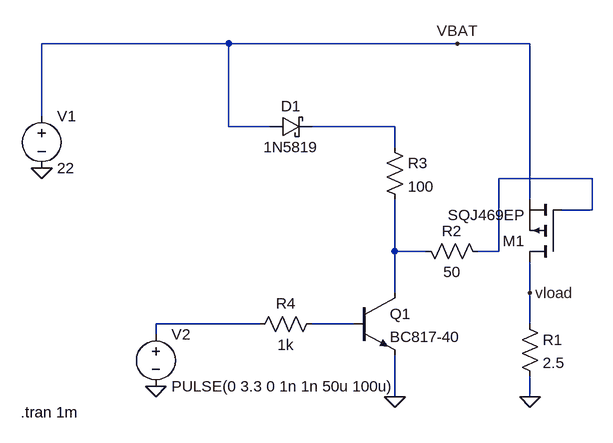
[diagram p0: schematic IceLander-Power-Switching.asc]
IceLander-Power-Switching.asc, the LTspice schematic file:
Version 4
SHEET 1 880 680
WIRE -192 -64 -480 -64
WIRE 160 -64 -192 -64
WIRE 272 -64 160 -64
WIRE -480 48 -480 -64
WIRE -192 64 -192 -64
WIRE -128 64 -192 64
WIRE 64 64 -64 64
WIRE 64 96 64 64
WIRE 368 144 224 144
WIRE 272 176 272 -64
WIRE 368 192 368 144
WIRE 368 192 320 192
WIRE 64 256 64 176
WIRE 112 256 64 256
WIRE 224 256 224 144
WIRE 224 256 192 256
WIRE 64 320 64 256
WIRE 272 320 272 272
WIRE -144 368 -304 368
WIRE 0 368 -64 368
WIRE 272 368 272 320
WIRE -304 384 -304 368
WIRE 64 480 64 416
WIRE 272 480 272 448
FLAG 272 480 0
FLAG 64 480 0
FLAG 160 -64 VBAT
FLAG -480 128 0
FLAG -304 464 0
FLAG 272 320 vload
SYMBOL pmos 320 272 R180
SYMATTR InstName M1
SYMATTR Value SQJ469EP
SYMBOL res 256 352 R0
SYMATTR InstName R1
SYMATTR Value 2.5
SYMBOL npn 0 320 R0
SYMATTR InstName Q1
SYMATTR Value BC817-40
SYMBOL res 96 240 M90
WINDOW 0 0 56 VBottom 2
WINDOW 3 32 56 VTop 2
SYMATTR InstName R2
SYMATTR Value 50
SYMBOL res 48 80 R0
SYMATTR InstName R3
SYMATTR Value 100
SYMBOL schottky -128 80 R270
WINDOW 0 32 32 VTop 2
WINDOW 3 0 32 VBottom 2
SYMATTR InstName D1
SYMATTR Value 1N5819
SYMATTR Description Diode
SYMATTR Type diode
SYMBOL res -48 352 R90
WINDOW 0 0 56 VBottom 2
WINDOW 3 32 56 VTop 2
SYMATTR InstName R4
SYMATTR Value 1k
SYMBOL voltage -480 32 R0
WINDOW 123 0 0 Left 0
WINDOW 39 0 0 Left 0
SYMATTR InstName V1
SYMATTR Value 22
SYMBOL voltage -304 368 R0
WINDOW 123 0 0 Left 0
WINDOW 39 0 0 Left 0
SYMATTR InstName V2
SYMATTR Value PULSE(0 3.3 0 1n 1n 50u 100u)
TEXT -512 504 Left 2 !.tran 1m

The netlist it stands for:
* IceLander-Power-Switching.asc
M1 vload N002 VBAT VBAT SQJ469EP
R1 vload 0 2.5
Q1 N003 N005 0 0 BC817-40
R2 N003 N002 50
R3 N001 N003 100
D1 VBAT N001 1N5819
R4 N005 N004 1k
V1 VBAT 0 22
V2 N004 0 PULSE(0 3.3 0 1n 1n 50u 100u)
.model D D
.lib standard.dio
.model NPN NPN
.model PNP PNP
.lib standard.bjt
.model NMOS NMOS
.model PMOS PMOS
.lib standard.mos
.tran 1m
.backanno
.end